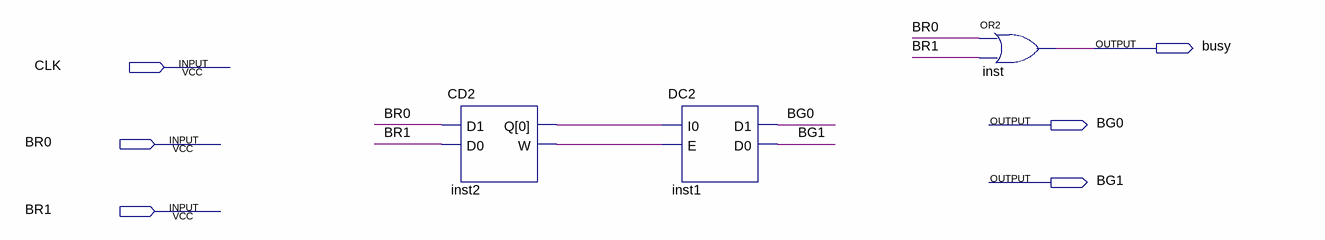
[diagram p0: schematic sheet]
// Quartus schematic Arbitrator.bdf as structural Verilog: 3 symbols, 6 pins
module Arbitrator (
  input  CLK,
  input  BR0,
  input  BR1,
  output busy,
  output BG0,
  output BG1
);

  wire inst2_q, inst2_w;

  CD2 inst2 (.D1(BR0), .D0(BR1), .Q(inst2_q), .W(inst2_w));
  DC2 inst1 (.I0(inst2_q), .E(inst2_w), .D1(BG0), .D0(BG1));
  or inst (busy, BR0, BR1);
endmodule
